# Altium schematic sheet Regulator.SchDoc
size 228 x 177 mm; SheetNumber: 2; SheetTotal: 5; SPICEModelCacheUFDFYBAD: <root> / <DocumentId>UFDFYBAD</DocumentId> / <CacheFrame Number="0"> / <Model Name="860040875005_100uf" Kind="CKT"> / <Text>******* / .subckt 860040875005_100uF 1 2 / Rser 1 3 0.144 / Lser 2 4 0.000000005 / C1 3 4 0.0001 / Rpar 3 4 1000000 / .ends 860040875005_100uF</Text> / </Model> / <Model Name="4532_744773047_4.7u" Kind="CKT"> / <Text>******* / .subckt 4532_744773047_4.7u 1 2 / Rp 1 2 14200 / Cp 1 2 1.95p / Rs 1 N3 0.059 / L1 N3 2 4.7u / .ends 4532_744773047_4.7u</Text> / </Model> / <Model Name="2220_885012214006_10uf" Kind="CKT"> / <Text>******* / .subckt 2220_885012214006_10uF 1 2 / Rser 1 3 0.003 / Lser 2 4 0.0000000012 / C1 3 4 0.00001 / Rpar 3 4 10000000 / .ends 2220_885012214006_10uF</Text> / </Model> / <Model Name="1210_885012209074_22uf" Kind="CKT"> / <Text>******* / .subckt 1210_885012209074_22uF 1 2 / Rser 1 3 0.0043 / Lser 2 4 0.000000001 / C1 3 4 0.000022 / Rpar 3 4 5000000 / .ends 1210_885012209074_22uF</Text> / </Model> / </CacheFrame> / </root>
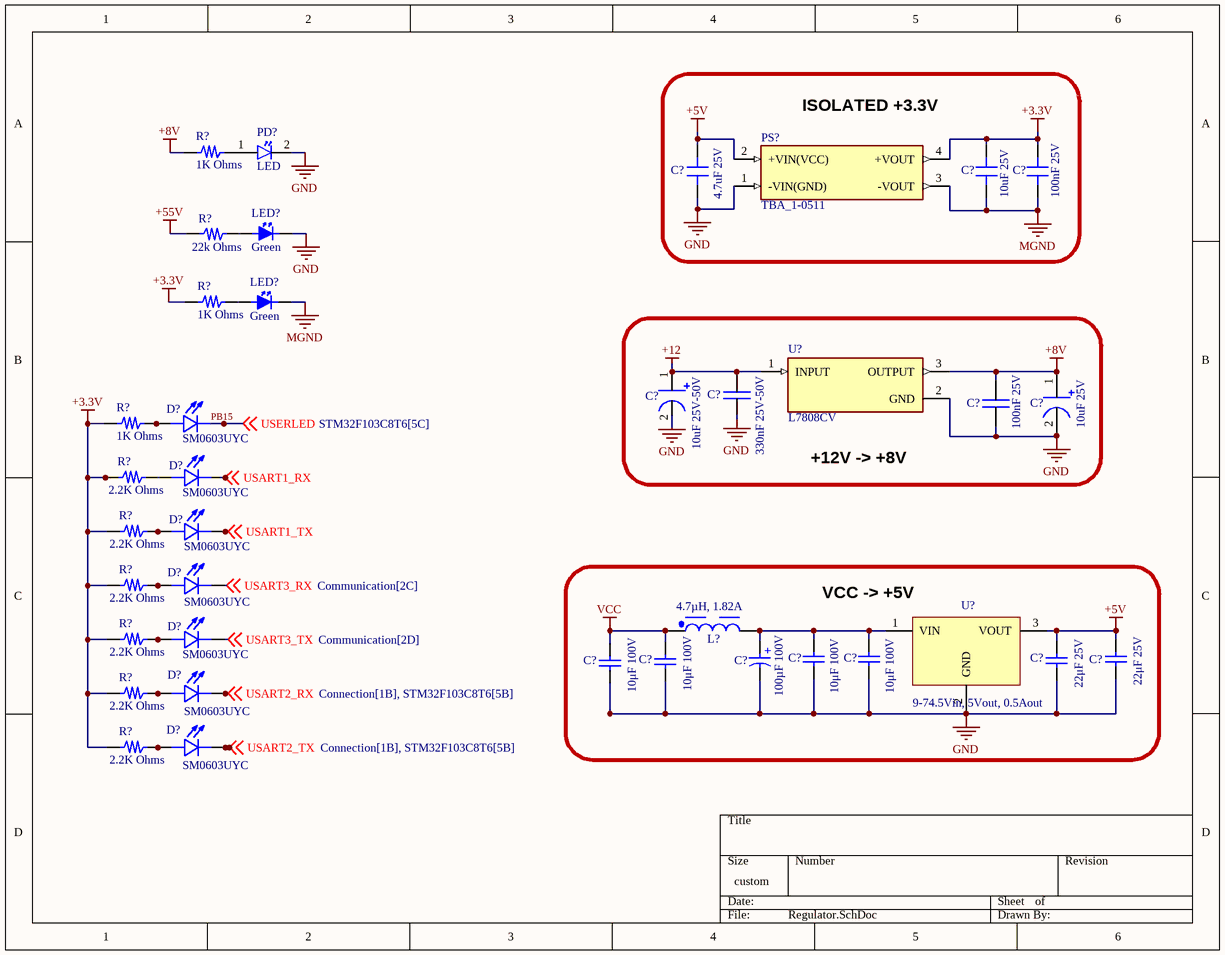
[diagram p0: Regulator.SchDoc]

## Parts
(Parts that share a designator on the sheet are numbered #1, #2 ... from top to bottom, then left to right.)
C?#1  4.7uF 25V  [0805_CAP]
C?#2  10uF 25V  [0805_CAP]
C?#3  100nF 25V  [0805_CAP]
C?#4  330nF 25V-50V  [Cap_0.2in]
C?#5  100nF 25V  [Cap_0.2in]
C?#6  10uF 25V-50V  [Cap 18uF 63V]
C?#7  10uF 25V  [Cap 18uF 63V]
C?#8  100µF 100V  [WCAP-ATUL_D10H25]
C?#9  10μF 100V  [WCAP-CSGP_2220_L5.7W5H2.8]
C?#10  10μF 100V  [WCAP-CSGP_2220_L5.7W5H2.8]
C?#11  10μF 100V  [WCAP-CSGP_2220_L5.7W5H2.8]
C?#12  10μF 100V  [WCAP-CSGP_2220_L5.7W5H2.8]
C?#13  22μF 25V  [WCAP-CSGP_1210_L3.2W2.5H2.5]
C?#14  22μF 25V  [WCAP-CSGP_1210_L3.2W2.5H2.5]
D?#1  SM0603UYC  [LED_SM0603UYC]
D?#2  SM0603UYC  [LED_SM0603UYC]
D?#3  SM0603UYC  [LED_SM0603UYC]
D?#4  SM0603UYC  [LED_SM0603UYC]
D?#5  SM0603UYC  [LED_SM0603UYC]
D?#6  SM0603UYC  [LED_SM0603UYC]
D?#7  SM0603UYC  [LED_SM0603UYC]
L?  4.7µH, 1.82A  [WE-PD2_4532]
LED?#1  Green  [0805LED]
LED?#2  Green  [0805LED]
PD?  LED  [Led_3mm]
PS?  TBA_1-0511  [CONV_TBA_1-0511]
R?#1  1K Ohms  [0603_RES]
R?#2  22k Ohms  [0805_RES]
R?#3  1K Ohms  [0603_RES]
R?#4  1K Ohms  [0603_RES]
R?#5  2.2K Ohms  [0603_RES]
R?#6  2.2K Ohms  [0603_RES]
R?#7  2.2K Ohms  [0603_RES]
R?#8  2.2K Ohms  [0603_RES]
R?#9  2.2K Ohms  [0603_RES]
R?#10  2.2K Ohms  [0603_RES]
U?#1  L7808CV  [TO255P1020X450X1968-3B]
U?#2  9-74.5Vin, 5Vout, 0.5Aout  [WPME-FDSM_SIP-3_L11.5W9H17.5]

## Blocks framed on the sheet
ISOLATED +3.3V: C?#1-C?#3 PS?
+12V -> +8V: C?#4-C?#7 U?#1
VCC -> +5V: C?#8-C?#14 L? U?#2

## Nets
+3.3V: C?#2.2 C?#3.2 PS?.4(+VOUT) R?#3.1 R?#4.1 R?#5.1 R?#6.1 R?#7.1 R?#8.1 R?#9.1 R?#10.1
+5V: C?#1.2 C?#13.2 C?#14.2 PS?.2(+VIN(VCC)) U?#2.3(VOUT)
+8V: C?#5.2 C?#7.1 R?#1.1 U?#1.3(OUTPUT)
+12: C?#4.2 C?#6.1 U?#1.1(INPUT)
+55V: R?#2.2
GND: C?#1.1 C?#4.1 C?#5.1 C?#6.2 C?#7.2 C?#8.2(N) C?#9.1 C?#10.1 C?#11.1 C?#12.1 C?#13.1 C?#14.1 LED?#1.2(Cathode(-)) PD?.2(-) PS?.1(-VIN(GND)) U?#1.2(GND)
MGND: C?#2.1 C?#3.1 LED?#2.2(Cathode(-)) PS?.3(-VOUT)
VCC: C?#9.2 C?#10.2 L?.1
PB15: D?#1.C ; off-sheet USERLED  [also labelled USERLED]
USART1_RX: D?#2.C ; off-sheet USART1_RX
USART1_TX: D?#3.C ; off-sheet USART1_TX
USART2_RX: D?#6.C ; off-sheet USART2_RX
USART2_TX: D?#7.C ; off-sheet USART2_TX
USART3_RX: D?#4.C ; off-sheet USART3_RX
USART3_TX: D?#5.C ; off-sheet USART3_TX
NetC?#8_1: C?#8.1(P) C?#11.2 C?#12.2 L?.2 U?#2.1(VIN)
NetD?#1_A: D?#1.A R?#4.2
NetD?#2_A: D?#2.A R?#5.2
NetD?#3_A: D?#3.A R?#6.2
NetD?#4_A: D?#4.A R?#7.2
NetD?#5_A: D?#5.A R?#8.2
NetD?#6_A: D?#6.A R?#9.2
NetD?#7_A: D?#7.A R?#10.2
NetLED?#1_1: LED?#1.1(Anode(+)) R?#2.1
NetLED?#2_1: LED?#2.1(Anode(+)) R?#3.2
NetPD?_1: PD?.1(+) R?#1.2

Not connected (* = marked no-connect by the designer): U?#2 2(GND)

## Notes on the sheet
- (in symbol 860040875005) +

## Library data of the parts
C?#1-C?#3 = CAP_0805: Value: 100nF 16V
C?#4 C?#5 = Capacitor: 200mil Coil Pitch
C?#6 C?#7 = Capacitor_1: 10uF 63V
C?#8 = 860040875005: WCAP-ATUL Aluminum Electrolytic Capacitor, Radial, THT, D10 x H25mm, 100µF, 100V; Manufacturer: Wurth Elektronik; Capacitance Tolerance: 20%; Dissipation Factor: 9%; Endurance: 7000h; Leakage Current: 100µA; Ripple Current: 800mA; Technical Reference: ATDF250101M100DSPAAG000; Manufacturer Part Number: 860040875005; Category: Aluminum Electrolytic Capacitors; Match Code: WCAP-ATUL; ComponentLink1Description: Website Link; ComponentLink1URL: https://www.we-online.com/redexpert/article/860040875005?ad; ComponentLink2Description: Datasheet Link; ComponentLink2URL: https://www.we-online.com/redexpert/spec/860040875005?ad; Mount: Through Hole; Operating Temperature Max: 105°C; Operating Temperature Min: -40°C; Packaging: Ammo Pack; Height: 25mm; Diameter: 10mm; Capacitance: 100µF; Rated Voltage (DC): 100V
C?#9-C?#12 = 885012214006: WCAP-CSGP Multilayer Ceramic Chip Capacitor, General Purpose, size 2220, X7R Class II, 10μF, 100V; Manufacturer: Wurth Elektronik; Case/Size Code: 2220; Capacitance Tolerance: +/-10%; Dissipation Factor: 2.5%; Insulation Resistance: 0.01GΩ; Technical Reference: X7R2220106K100DFCT10000; Manufacturer Part Number: 885012214006; Category: Multilayer Ceramic Chip Capacitors; Match Code: WCAP-CSGP; ComponentLink1Description: Website Link; ComponentLink1URL: https://www.we-online.com/redexpert/article/885012214006?ad; ComponentLink2Description: Datasheet Link; ComponentLink2URL: https://www.we-online.com/redexpert/spec/885012214006?ad; Mount: Surface Mount; Min Operating Temperature: -55°C; Max Operating Temperature: 125°C; Packaging: Tape and Reel; Length: 5.7mm; Width: 5mm; Height: 2.8mm; Capacitance: 10μF; Ceramic Type: X7R Class II; Rated Voltage (DC): 100V
C?#13 C?#14 = 885012209074: WCAP-CSGP Multilayer Ceramic Chip Capacitor, General Purpose, size 1210, X7R, 22μF, 25V; Manufacturer: Wurth Elektronik; Case/Size Code: 1210; Capacitance Tolerance: +/10%; Dissipation Factor: 10%; Insulation Resistance: 0.005GΩ; Technical Reference: X7R1210226K025DFCT10000; Manufacturer Part Number: 885012209074; Category: Multilayer Ceramic Chip Capacitors; Match Code: WCAP-CSGP; ComponentLink1Description: Website Link; ComponentLink1URL: https://www.we-online.com/redexpert/article/885012209074?ad; ComponentLink2Description: Datasheet Link; ComponentLink2URL: https://www.we-online.com/redexpert/spec/885012209074?ad; Mount: Surface Mount; Min Operating Temperature: -55°C; Max Operating Temperature: 125°C; Packaging: Tape and Reel; Length: 3.2mm; Width: 2.5mm; Height: 2.5mm; Capacitance: 22μF; Ceramic Type: X7R; Rated Voltage (DC): 25V
D?#1-D?#7 = SM0603UYC: LED SMD 0603 Ultra Yellow 593nm 70mcd Water Clear Lens 130 Deg Viewing Angle | Bivar Inc. SM0603UYC; SnapEDA_Link: https://www.snapeda.com/parts/SM0603UYC/Bivar/view-part/?ref=snap; Package: 0603 Bivar; Value: *; MF: Bivar; MP: SM0603UYC; Check_prices: https://www.snapeda.com/parts/SM0603UYC/Bivar/view-part/?ref=eda
L? = 744773047: WE-PD2 SMT Power Inductor, size 4532, 4.7µH, 1.82A, 0.11Ω; Manufacturer: Wurth Elektronik; Case/Size Code: 4532; DC Resistance: 0.059Ω; Saturation Current: 2.46A; Self Resonant Frequency: 50MHz; Manufacturer Part Number: 744773047; Category: Unshielded Power Inductors; Match Code: WE-PD2; ComponentLink1Description: Website Link; ComponentLink1URL: https://www.we-online.com/redexpert/article/744773047?ad; ComponentLink2Description: Datasheet Link; ComponentLink2URL: https://www.we-online.com/redexpert/spec/744773047?ad; Mount: Surface Mount; Operating Temperature Max: 125°C; Operating Temperature Min: -40°C; Packaging: Tape and Reel; Length: 4.5mm; Width: 4mm; Height: 3.2mm; DC Resistance Max: 0.11Ω; Inductance: 4.7µH; Rated Current: 1.82A
LED?#1 LED?#2 = LED: 0805
PD? = LED_2: 100mil DIP LED
R?#1 R?#3-R?#10 = RES_0603: 0603; Value: 0/10 Ohms; Power: 1/8W
R?#2 = RES_0805: 0805; Power: 1/8 W; Value: 22k Ohms
U?#1 = L7808CV: Linear Voltage Regulator IC Positive Fixed 1 Output 1.5A TO-220; MF: STMicroelectronics; SnapEDA_Link: https://www.snapeda.com/parts/L7808CV/STMicroelectronics/view-part/?ref=snap; Package: TO-220-3 STMicroelectronics; Value: *; MP: L7808CV; Check_prices: https://www.snapeda.com/parts/L7808CV/STMicroelectronics/view-part/?ref=eda
U?#2 = 173950575: WPME-FDSM Fixed Step Down Regulator Module, THT, SIP-3, 9-74.5Vin, 5Vout, 0.5Aout; Manufacturer: Wurth Elektronik; Input Voltage Min: 9V; Input Voltage Max: 74.5V; Output Current: 0.5A; Output Voltage: 5V; Manufacturer Part Number: 173950575; Category: Step Down Converter; Match Code: WPME-FDSM; ComponentLink1Description: Website Link; ComponentLink1URL: https://www.we-online.com/redexpert/article/173950575?ad; ComponentLink2Description: Datasheet Link; ComponentLink2URL: https://www.we-online.com/redexpert/spec/173950575?ad; Mount: Through Hole; Operating Temperature Max: 85°C; Operating Temperature Min: -40°C; Packaging: Tube; Case/Size Code: SIP-3; Length: 11.5mm; Width: 9mm; Height: 17.5mm
PS? = TBA_1-0511: Price: None; Package: None; Availability: Unavailable; Value: *; MP: TBA_1-0511